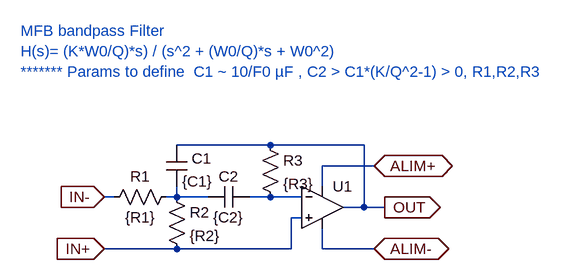
[diagram p0: schematic MFB-BandPass-part-SUB.asc]
MFB-BandPass-part-SUB.asc, the LTspice schematic file:
Version 4
SHEET 1 880 680
WIRE 112 48 -32 48
WIRE 256 48 112 48
WIRE 272 80 192 80
WIRE 192 112 192 80
WIRE -128 128 -144 128
WIRE -32 128 -32 112
WIRE -32 128 -48 128
WIRE 16 128 -32 128
WIRE 112 128 80 128
WIRE 160 128 112 128
WIRE 256 144 256 48
WIRE 256 144 224 144
WIRE 288 144 256 144
WIRE 160 160 144 160
WIRE -32 208 -144 208
WIRE 144 208 144 160
WIRE 144 208 -32 208
WIRE 192 208 192 176
WIRE 272 208 192 208
FLAG 272 80 ALIM+
IOPIN 272 80 BiDir
FLAG 272 208 ALIM-
IOPIN 272 208 BiDir
FLAG 288 144 OUT
IOPIN 288 144 Out
FLAG -144 128 IN-
IOPIN -144 128 In
FLAG -144 208 IN+
IOPIN -144 208 In
SYMBOL Opamps\\UniversalOpamp2 192 144 R0
SYMATTR InstName U1
SYMBOL res -32 112 R90
WINDOW 0 0 56 VBottom 2
WINDOW 3 32 56 VTop 2
SYMATTR InstName R1
SYMATTR Value {R1}
SYMBOL res -48 112 R0
SYMATTR InstName R2
SYMATTR Value {R2}
SYMBOL res 96 32 R0
SYMATTR InstName R3
SYMATTR Value {R3}
SYMBOL cap -48 48 R0
WINDOW 0 39 21 Left 2
SYMATTR InstName C1
SYMATTR Value {C1}
SYMBOL cap 16 112 M90
WINDOW 0 0 32 VBottom 2
WINDOW 3 32 32 VTop 2
SYMATTR InstName C2
SYMATTR Value {C2}
TEXT -272 -128 Left 2 ;MFB bandpass Filter\nH(s)= (K*W0/Q)*s) / (s^2 + (W0/Q)*s + W0^2)\n******* Params to define  C1 ~ 10/F0 µF , C2 > C1*(K/Q^2-1) > 0, R1,R2,R3

The netlist it stands for:
* MFB-BandPass-part-SUB.asc
XU1 IN+ N002 ALIM+ ALIM- OUT level.2 Avol=1Meg GBW=10Meg Slew=10Meg ilimit=25m rail=0 Vos=0 phimargin=45 en=0 enk=0 in=0 ink=0 Rin=500Meg  ; pins IN+ IN- V+ V- OUT
R1 N001 IN- {R1}
R2 N001 IN+ {R2}
R3 OUT N002 {R3}
C1 OUT N001 {C1}
C2 N001 N002 {C2}
* MFB bandpass Filter
* H(s)= (K*W0/Q)*s) / (s^2 + (W0/Q)*s + W0^2)
* ******* Params to define  C1 ~ 10/F0 µF , C2 > C1*(K/Q^2-1) > 0, R1,R2,R3
.lib UniversalOpamps2.sub
.backanno
.end